# EAGLE design MySecondMicrocontroller (EAGLE 9.0.1)

## Sheet 1 of 3
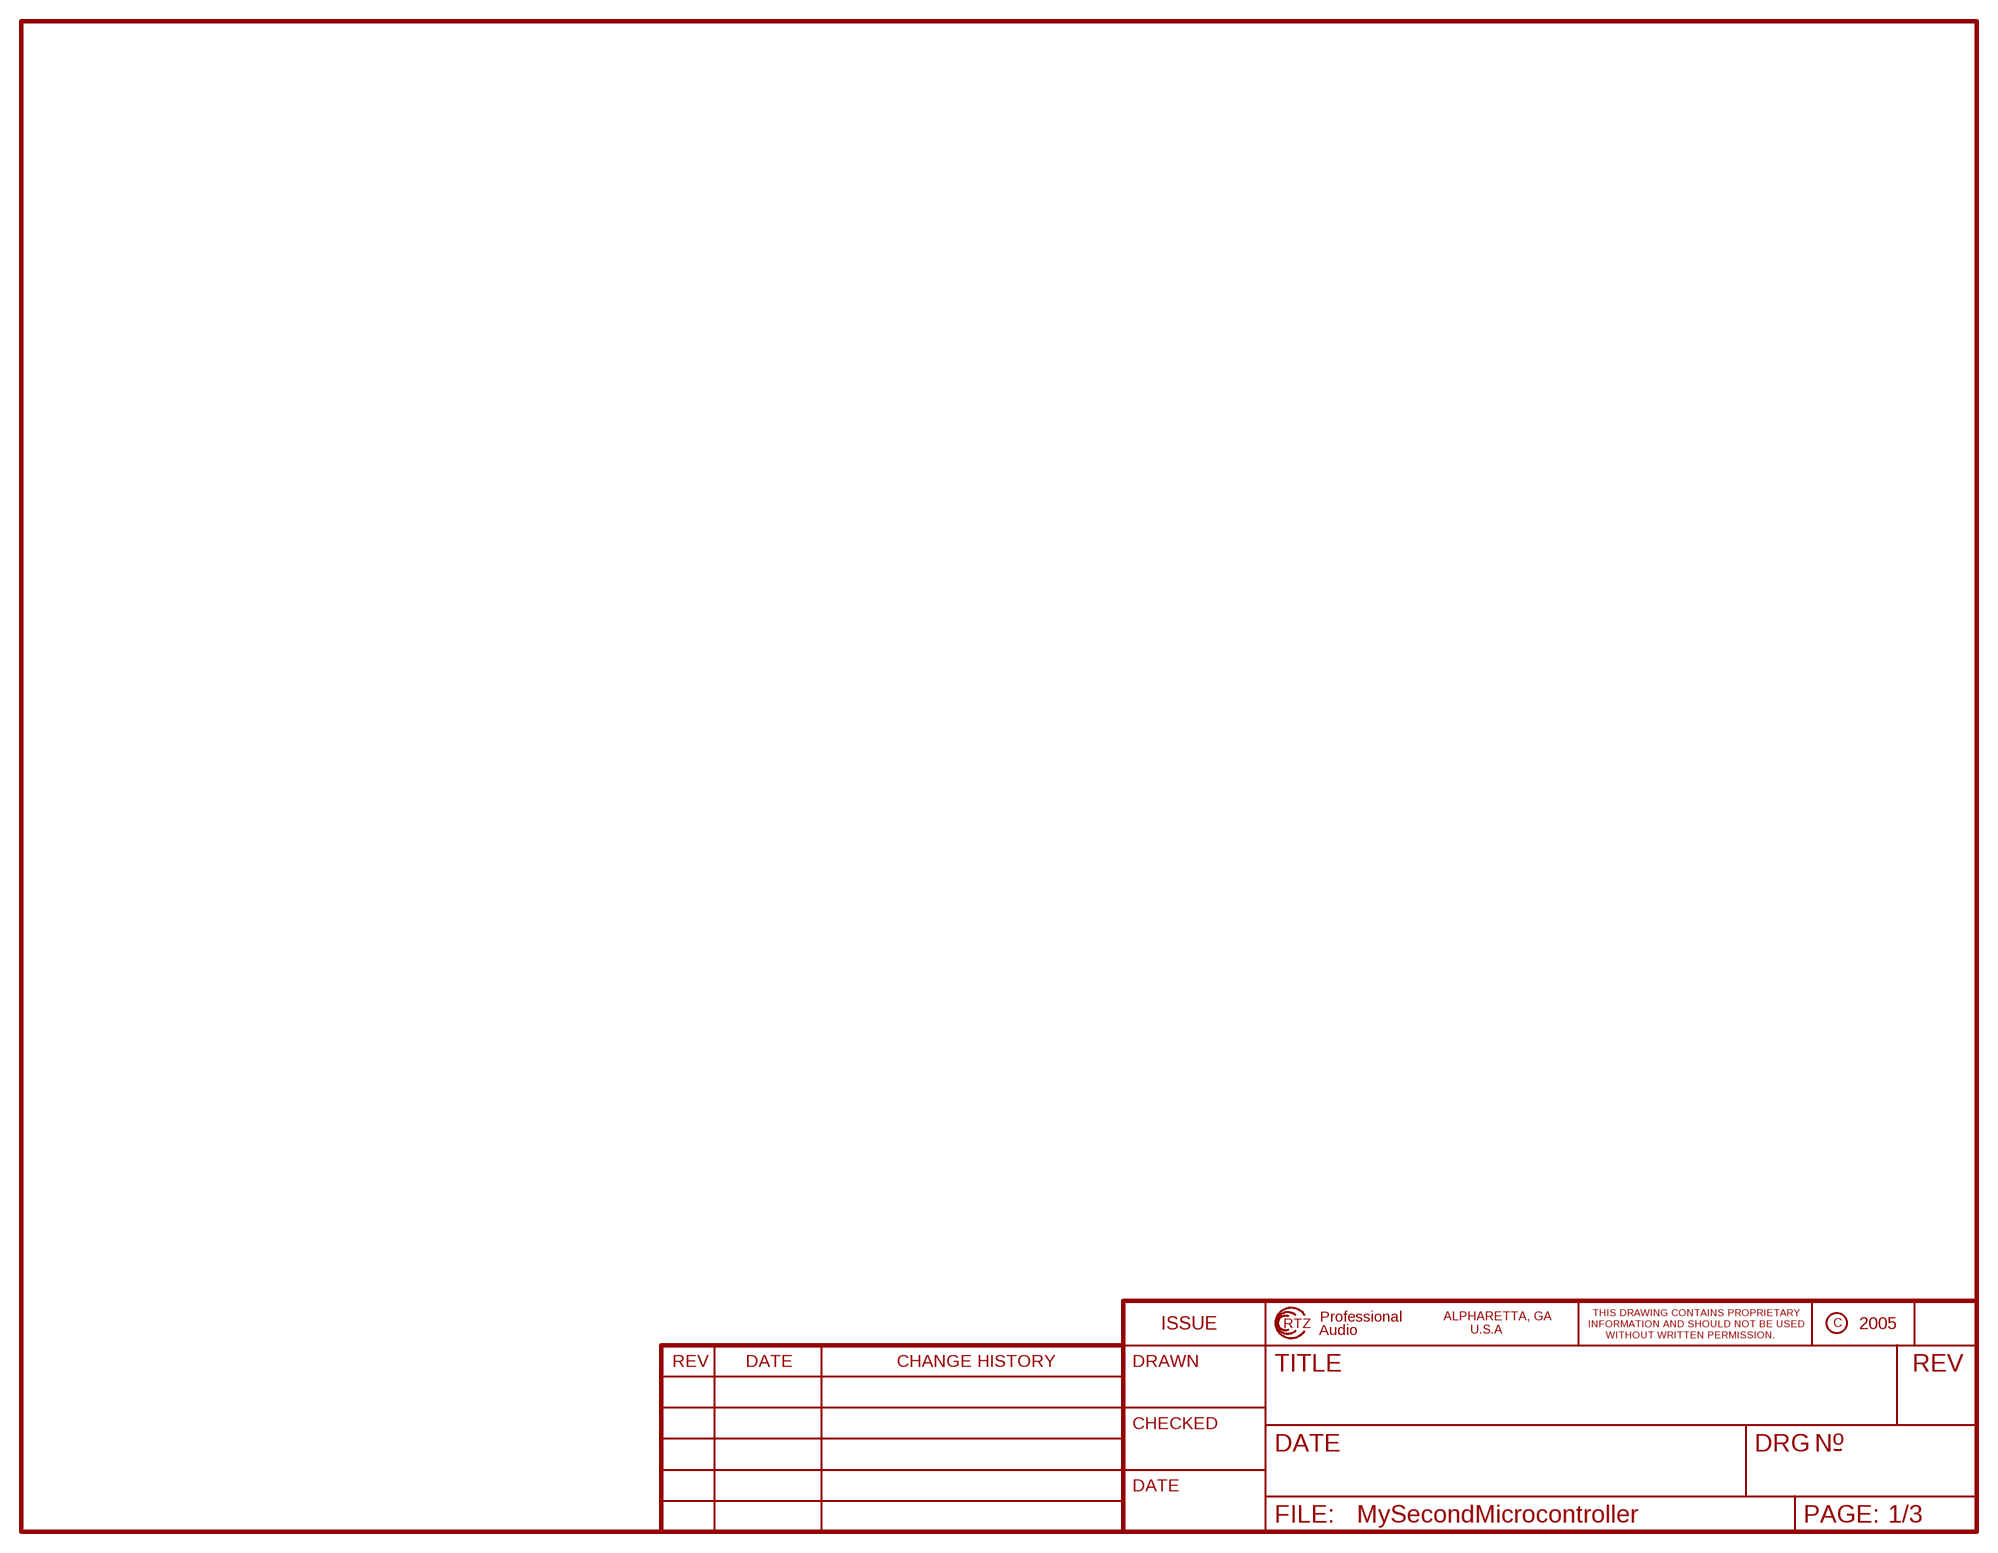
[diagram p0: schematic, sheet 1]

## Sheet 2 of 3
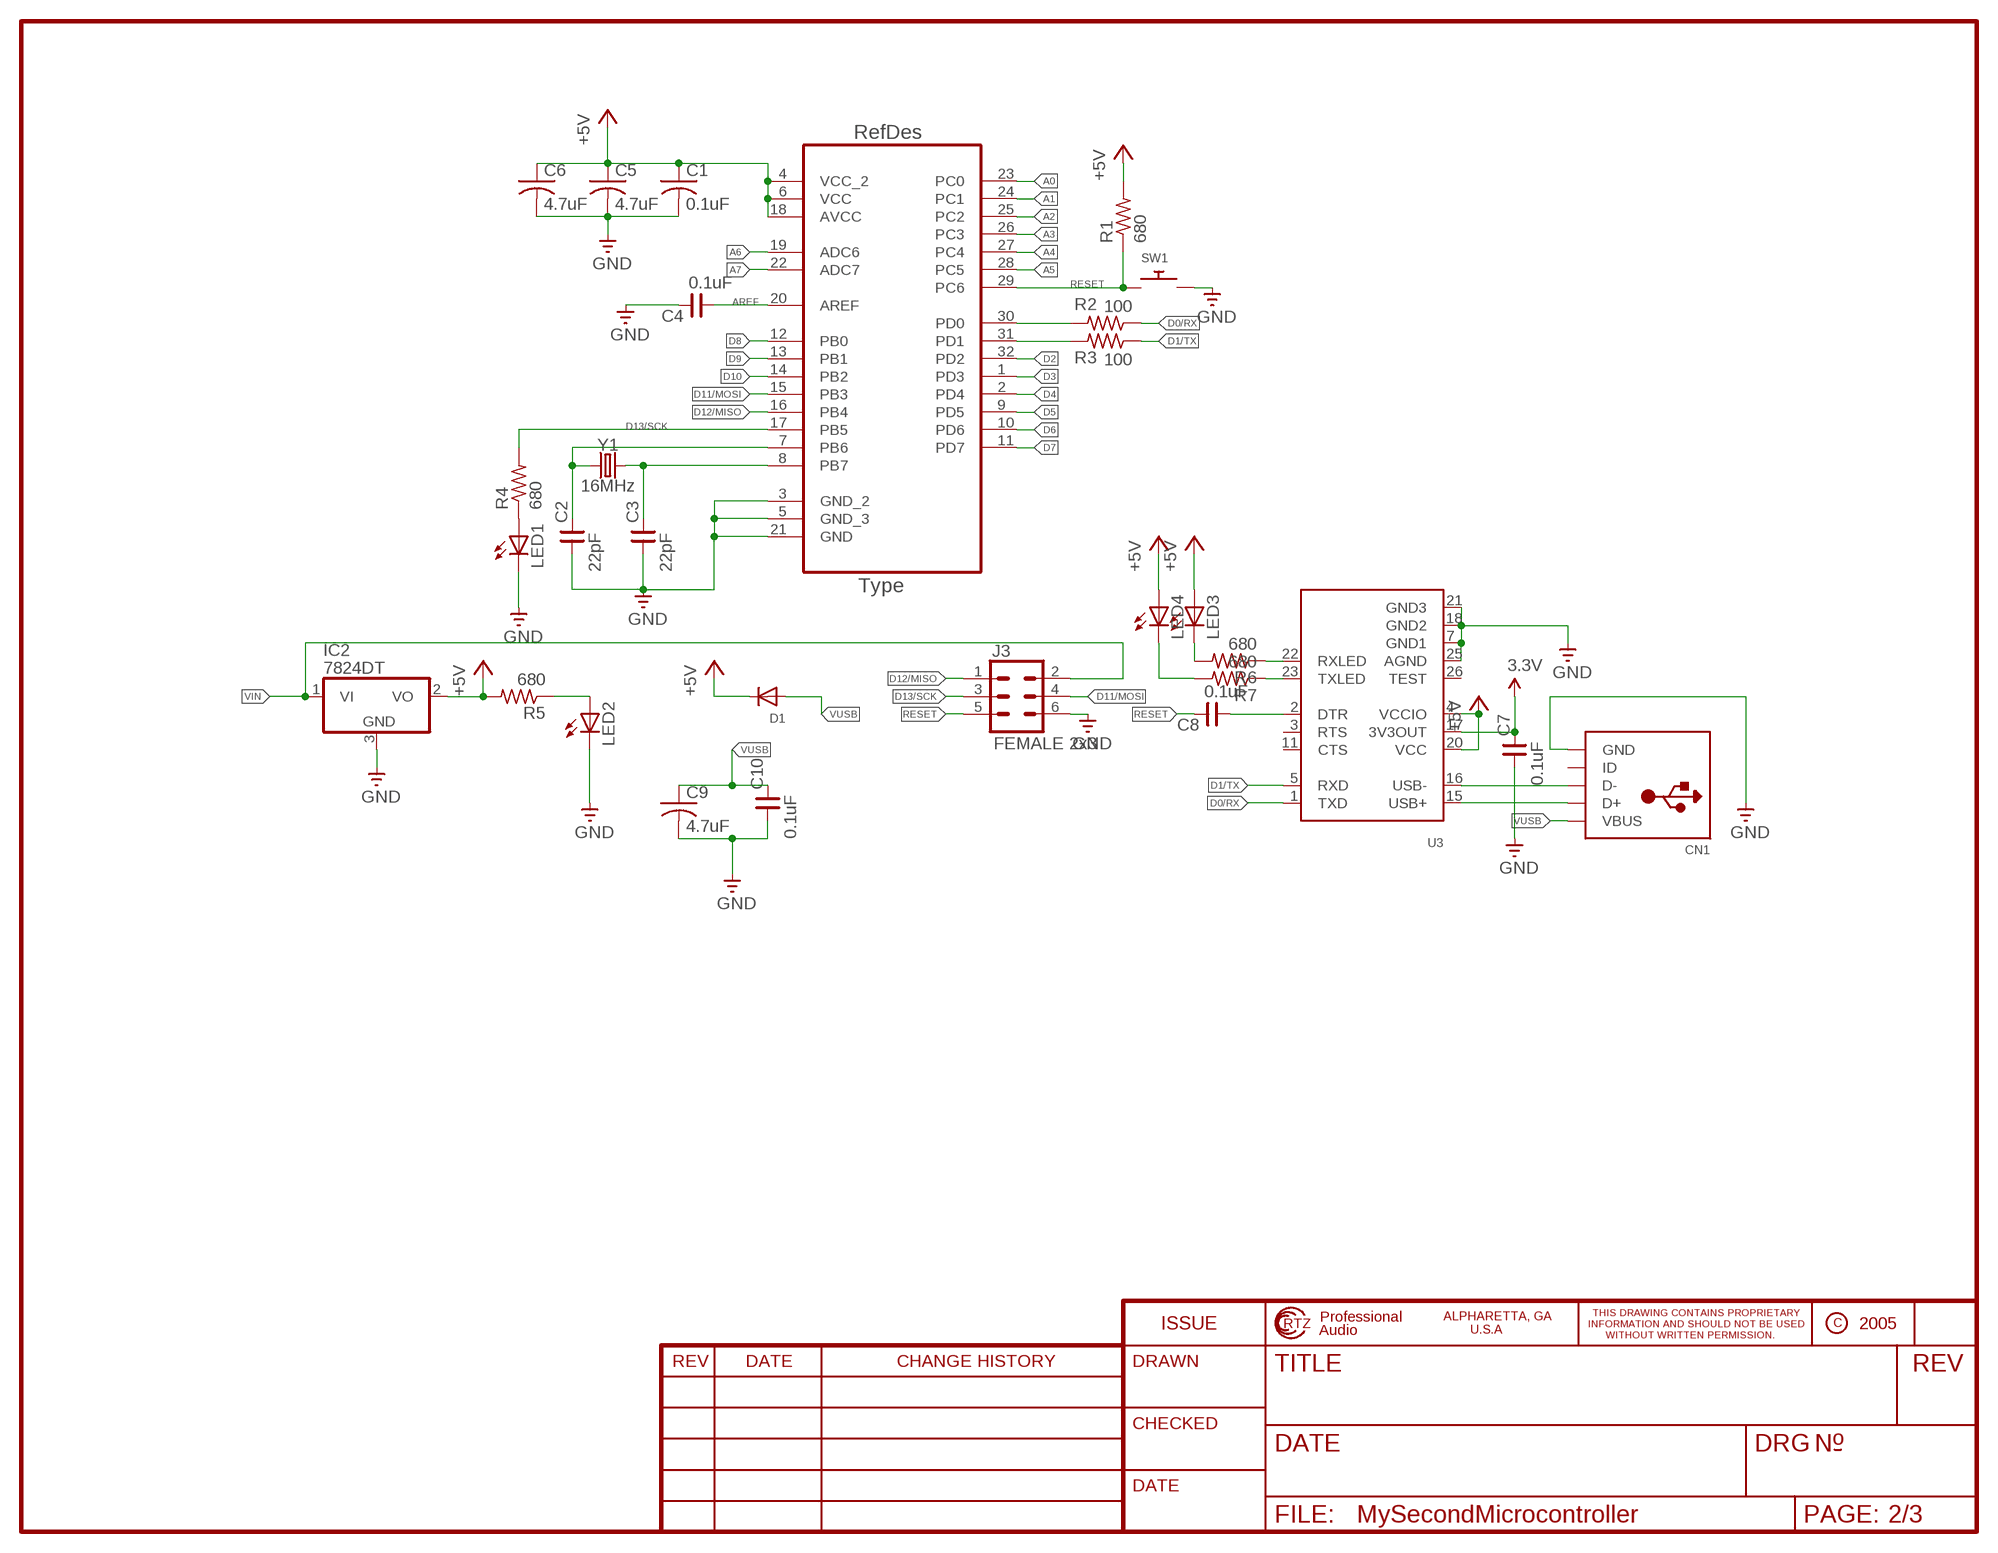
[diagram p1: schematic, sheet 2]

### Parts
C1  0.1uF  C-USC0805  [C0805]
C2  22pF  CNP-0805  [0805]
C3  22pF  CNP-0805  [0805]
C4  0.1uF  CNP-0805  [0805]
C5  4.7uF  C-USC0805  [C0805]
C6  4.7uF  C-USC0805  [C0805]
C7  0.1uF  CNP-0805  [0805]
C8  0.1uF  CNP-0805  [0805]
C9  4.7uF  C-USC0805  [C0805]
C10  0.1uF  CNP-0805  [0805]
CN1  USBMINIB  [USB-MINIB]
D1  DIODESOD-123  [SOD-123]
IC2  7824DT  [TO252]
J3  FEMALE 2x3  CONN_03X2FEMALE  [2X3]
LED1  LEDCHIPLED_0805  [CHIPLED_0805]
LED2  LEDCHIPLED_0805  [CHIPLED_0805]
LED3  LEDCHIPLED_0805  [CHIPLED_0805]
LED4  LEDCHIPLED_0805  [CHIPLED_0805]
R1  680  R-US_R0805  [R0805]
R2  100  R-US_R0805  [R0805]
R3  100  R-US_R0805  [R0805]
R4  680  R-US_R0805  [R0805]
R5  680  R-US_R0805  [R0805]
R6  680  R-US_R0805  [R0805]
R7  680  R-US_R0805  [R0805]
SW1  SWITCH_PUSHBUTTONEVQ-PE  [TACT_PANA-EVQ]
U2  ATMEGA328P-AU  [QFP80P900X900X120-32N]
U3  FT232RLSSOP28  [SSOP28DB]
Y1  16MHz  CRYSTAL-16MHZPTH-HC49US  [HC49US]

### Nets
3.3V: C7.2 U3.17(3V3OUT)
+5V [5V]: C1.1 C5.1 C6.1 D1.C IC2.2(VO) LED3.A LED4.A R1.2 R5.2 U2.4(VCC_2) U2.6(VCC) U2.18(AVCC) U3.4(VCCIO) U3.20(VCC)
A0: U2.23(PC0)
A1: U2.24(PC1)
A2: U2.25(PC2)
A3: U2.26(PC3)
A4: U2.27(PC4)
A5: U2.28(PC5)
A6: U2.19(ADC6)
A7: U2.22(ADC7)
AREF: C4.1 U2.20(AREF)
D0/RX: R2.1 U3.1(TXD)
D1/TX: R3.1 U3.5(RXD)
D2: U2.32(PD2)
D3: U2.1(PD3)
D4: U2.2(PD4)
D5: U2.9(PD5)
D6: U2.10(PD6)
D7: U2.11(PD7)
D8: U2.12(PB0)
D9: U2.13(PB1)
D10: U2.14(PB2)
D11/MOSI: J3.4 U2.15(PB3)
D12/MISO: J3.1 U2.16(PB4)
D13/SCK: J3.3 R4.2 U2.17(PB5)
GND: C1.2 C2.1 C3.1 C4.2 C5.2 C6.2 C7.1 C9.2 C10.1 CN1.GND IC2.3(GND) J3.6 LED1.C LED2.C SW1.P$2 U2.3(GND_2) U2.5(GND_3) U2.21(GND) U3.7(GND1) U3.18(GND2) U3.21(GND3) U3.25(AGND)
N$1: C3.2 U2.8(PB7) Y1.2
N$2: C2.2 U2.7(PB6) Y1.1
N$4: LED2.A R5.1
N$5: CN1.D+ U3.15(USB+)
N$6: CN1.D- U3.16(USB-)
N$7: R2.2 U2.30(PD0)
N$8: R3.2 U2.31(PD1)
N$9: LED3.C R6.2
N$12: R6.1 U3.22(RXLED)
N$13: R7.1 U3.23(TXLED)
N$14: C8.1 U3.2(DTR)
N$15: LED4.C R7.2
RESET: C8.2 J3.5 R1.1 SW1.P$1 U2.29(PC6)
VIN: IC2.1(VI) J3.2
VUSB: C9.1 C10.2 CN1.VBUS D1.A
Unconnected: CN1.ID LED1.A R4.1 U3.3(RTS) U3.11(CTS) U3.26(TEST)

## Sheet 3 of 3

## Library data of the parts
C1 C5 C6 C9 = adafruit:C-US: CAPACITOR, American symbol
C2-C4 C7 C8 C10 = cap-master:CNP-: NON-POLARIZED CAP
CN1 = adafruit:USB: USB Connectors USBMINIB - Surface Mount Female Mini-B USB Connector 4UConnector: 06564 By microbuilder.eu Thru-hole RA Female Mini-B USB Connector 4UConnector: 18732 By ladyada.net
D1 = adafruit:DIODE: Diode SMADIODE - SMA Surface Mount Package 20V 1A Schottky Diode Digikey: 641-1014-6-ND DO-1N4148 - Through Hole Small Current Diode SOD-123 20V 1 A (.5mV Vf) Schottky Diode - Digikey: MBRX120TPMSCT-ND SOD-323 10V 570mA (.38mV Vf, 3ns) Schottky Diode - Digikey: ZLLS410CT-ND SOD-523 30V 30mA Schottky Diode (RB751S-40TE61) - Digikey: RB751S-40TE61CT-ND SOT23-R/W - SOT23 Package (R = Solder Paste/Reflow Ovens, W = Hand-Soldering) BAT54Film 40V 300mA - Digikey: 497-7162-1-ND
IC2 = adafruit:78*: Positive VOLTAGE REGULATOR Added bigger pads to the TO-92 package
J3 = SparkFun-Connectors:CONN_03X2: Multi connection point. Often used as Generic Header-pin footprint for 0.1 inch spaced/style header connections You can populate with any combo of single row headers, but if you'd like an exact match, check these: Header - 2x3 (Male, 0.1") <https://www.sparkfun.com/products/12807> (PRT-12807) Header - 2x3 (Female, 0.1") <https://www.sparkfun.com/products/13010> (PRT-13010) 2x3 Pin Shrouded Header <https://www.sparkfun.com/products/10877> (PRT-10877) On any of the 0.1 inch spaced packages, you can populate with these: Break Away Headers - Straight <https://www.sparkfun.com/products/116> (PRT-00116) Break Away Male Headers - Right Angle <https://www.sparkfun.com/products/553> (PRT-00553) Female Headers <https://www.sparkfun.com/products/115> (PRT-00115) Break Away Headers - Machine Pin <https://www.sparkfun.com/products/117> (PRT-00117) Break Away Female Headers - Swiss Machine Pin <https://www.sparkfun.com/products/743> (PRT-00743) Special note: the shrouded connector mates well with our 3x2 ribbon cables: Ribbon Crimp Connector - 6-pin (2x3, Female) <https://www.sparkfun.com/products/10651> (PRT-10651) Ribbon Cable - 6 wire (15ft) <https://www.sparkfun.com/products/10646> (PRT-10646); PROD_ID: CONN-11566
LED1-LED4 = adafruit:LED: LED OSRAM: - CHIPLED LG R971, LG N971, LY N971, LG Q971, LY Q971, LO R971, LY R971 LH N974, LH R974 LS Q976, LO Q976, LY Q976 LO Q996 - Hyper CHIPLED LW Q18S LB Q993, LB Q99A, LB R99A - SideLED LS A670, LO A670, LY A670, LG A670, LP A670 LB A673, LV A673, LT A673, LW A673 LH A674 LY A675 LS A676, LA A676, LO A676, LY A676, LW A676 LS A679, LY A679, LG A679 - Hyper Micro SIDELED® LS Y876, LA Y876, LO Y876, LY Y876 LT Y87S - SmartLED LW L88C, LW L88S LB L89C, LB L89S, LG L890 LS L89K, LO L89K, LY L89K LS L896, LA L896, LO L896, LY L896 - TOPLED LS T670, LO T670, LY T670, LG T670, LP T670 LSG T670, LSP T670, LSY T670, LOP T670, LYG T670 LG T671, LOG T671, LSG T671 LB T673, LV T673, LT T673, LW T673 LH T674 LS T676, LA T676, LO T676, LY T676, LB T676, LH T676, LSB T676, LW T676 LB T67C, LV T67C, LT T67C, LS T67K, LO T67K, LY T67K, LW E67C LS E67B, LA E67B, LO E67B, LY E67B, LB E67C, LV E67C, LT E67C LW T67C LS T679, LY T679, LG T679 LS T770, LO T770, LY T770, LG T770, LP T770 LB T773, LV T773, LT T773, LW T773 LH T774 LS E675, LA E675, LY E675, LS T675 LS T776, LA T776, LO T776, LY T776, LB T776 LHGB T686 LT T68C, LB T68C - Hyper Mini TOPLED® LB M676 - Mini TOPLED Santana® LG M470 LS M47K, LO M47K, LY M47K Source: http://www.osram.convergy.de/
R1-R7 = adafruit:R-US_: RESISTOR, American symbol
SW1 = adafruit:SWITCH_PUSHBUTTON: Buttons SOFTTOUCHSMD_SJ - Soft touch temporary push button (Super Junk Akihabara) Compatible with SKPMANE010 [Mouser: 688-SKPMAN] C&K_KSS = Digikey: KSS221GLFS
U2 = Atmel-ATMEGA328P-AU:ATMEGA328P-AU; DESCRIPTION: 8-bit Microcontroller with In-System Programmable Flash; MPN: ATMEGA328P-AU; OC_FARNELL: 1715486; OC_NEWARK: 14R4631; PACKAGE: TQFP-32; SUPPLIER: Atmel
U3 = microbuilder:FT232RL: FTDI FT232RL USB TO RS232 Converter Digikey: 768-1007-1-ND
Y1 = SparkFun-Clocks:CRYSTAL-16MHZ: 16MHz Crystal Digikey Example <http://www.digikey.com/product-search/en?keywords=535-9122-1-ND> Frequency: 16MHz Frequency Stability: ±50ppm Frequency Tolerance: ±20ppm Load Capacitance: 18pF SparkFun Products: Pro Micro -5V/16MHz <https://www.sparkfun.com/products/12640> SparkFun Serial Enabled LCD Kit <https://www.sparkfun.com/products/10097>; PROD_ID: XTAL-08181; SF_ID: COM-00536

## Net classes
0 default: width 0.152 mm
1 5V: width 0.508 mm

## Board
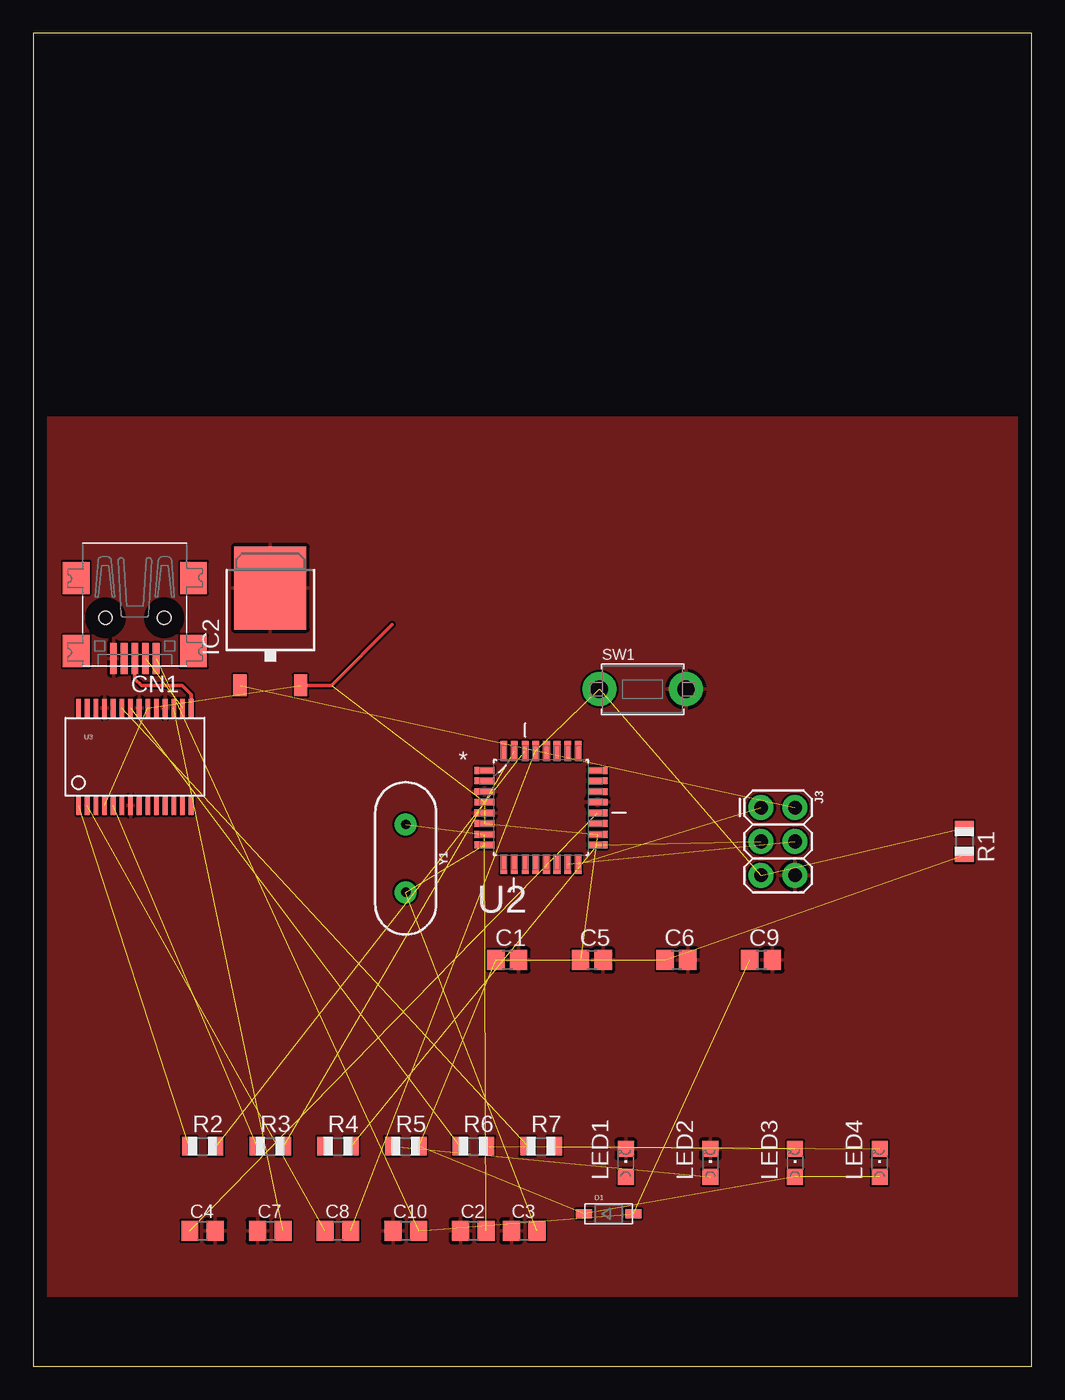
[diagram p2: board, top side]
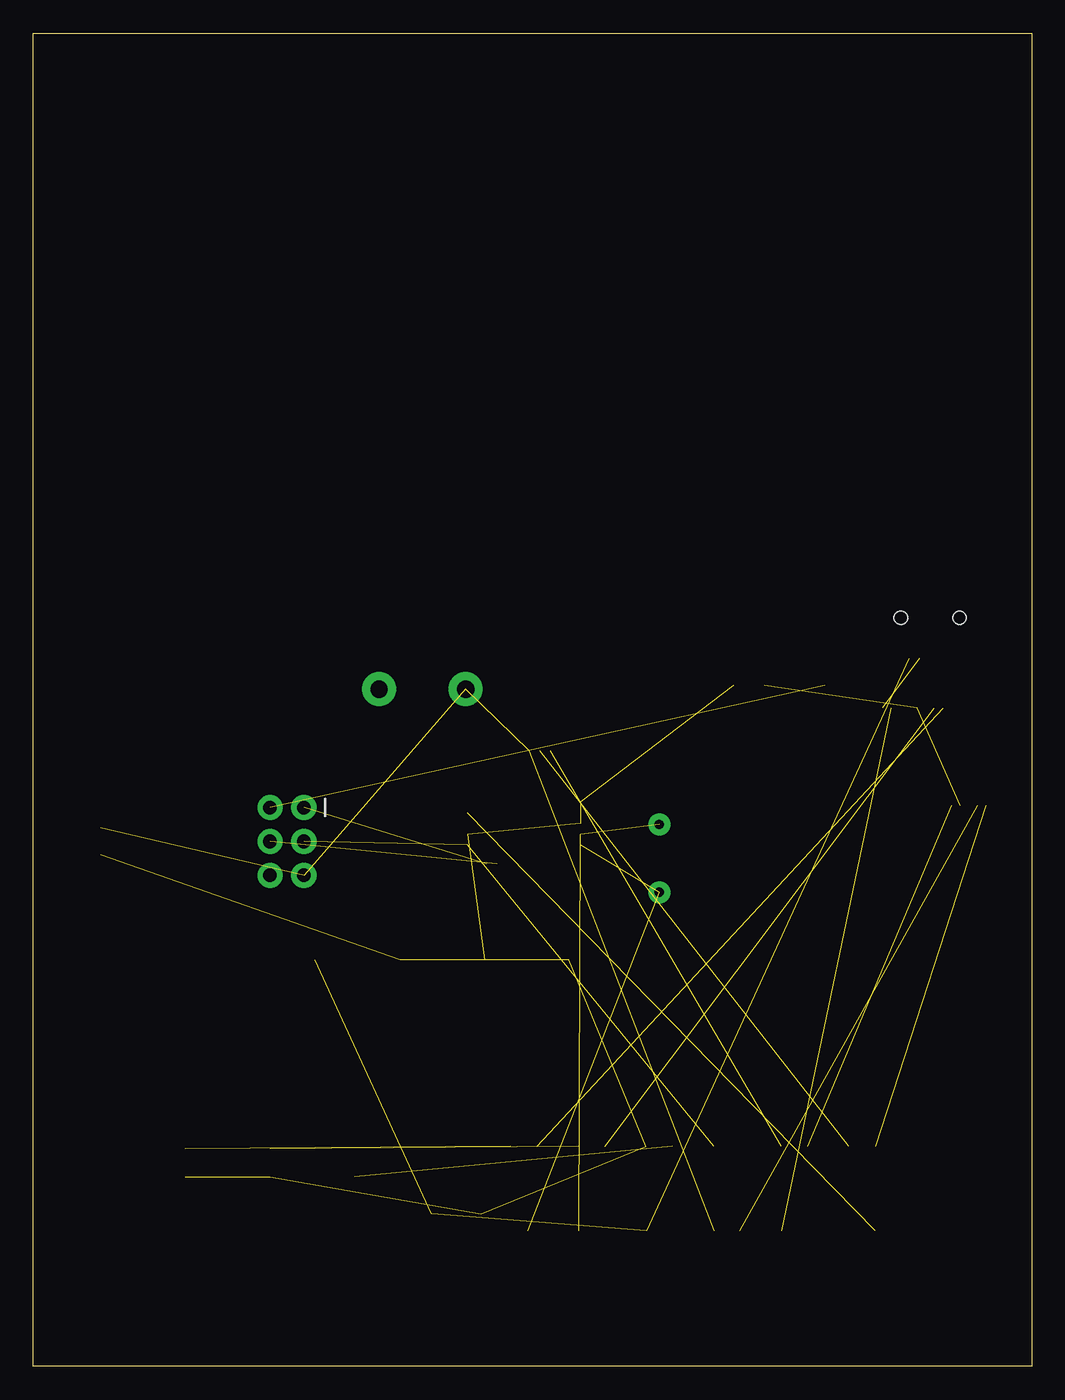
[diagram p3: board, bottom side, seen from below]

Size 74.91 x 100 mm. Coordinates in mm from the lower left corner, seen from the top.
Outline: 0,0 74.91,0 74.91,100 0,100 0,0
Copper layers (1*16): Top 0.035mm / dielectric 1.5mm / Bottom 0.035mm
Design rules "default": minimum track width 6mil, minimum drill 0.35mm, track to track 6mil, track to pad 6mil, pad to pad 6mil, via to via 6mil, smd to smd 6mil, copper to edge 40mil, drill to drill 6mil, minimum pad ring 10mil, minimum via ring 8mil, stop-mask expansion 4mil, vias tented up to drill 0mil, thermal gap 10mil

### Footprints (pad centres in the part's own frame; a part is rotated, then mirrored left to right if it is on the bottom)
C0805 = smd 1.3 x 1.5: 1 -0.85,0; 2 0.85,0
0805 = smd 1.27 x 1.524: 1 -0.953,0; 2 0.953,0
USB-MINIB = smd 0.5 x 2.308: D+ 0,4.064; D- -0.8,4.064; GND 1.6,4.064; ID 0.8,4.064; VBUS -1.6,4.064 | smd 2 x 2.4: GND1 -4.4,-2; GND2 -4.4,3.5; GND3 4.4,3.5; GND4 4.4,-2 | hole 1: -2.2,1; 2.2,1
SOD-123 = smd 1.2 x 0.7: A 1.85,0; C -1.85,0
TO252 = smd 1 x 1.6: 1 -2.28,-4.8; 2 2.28,-4.8 | smd 5.4 x 6.2: 3 0,2.5
2X3 = drill 1.016 pad 1.88: 1 0,0; 2 0,2.54; 3 2.54,0; 4 2.54,2.54; 5 5.08,0; 6 5.08,2.54
CHIPLED_0805 = smd 1.2 x 1.2: A 0,-1.05; C 0,1.05
R0805 = smd 1.1 x 1.4: 1 -1,0; 2 1,0
TACT_PANA-EVQ = drill 1.3 pad 2.54: P$1 -3.25,0; P$2 3.25,0
QFP80P900X900X120-32N = smd 1.473 x 0.508: 1 -4.242,2.794; 2 -4.242,2.007; 3 -4.242,1.194; 4 -4.242,0.406; 5 -4.242,-0.406; 6 -4.242,-1.194; 7 -4.242,-2.007; 8 -4.242,-2.794; 17 4.242,-2.794; 18 4.242,-2.007; 19 4.242,-1.194; 20 4.242,-0.406; 21 4.242,0.406; 22 4.242,1.194; 23 4.242,2.007; 24 4.242,2.794 | smd 0.508 x 1.473: 9 -2.794,-4.242; 10 -2.007,-4.242; 11 -1.194,-4.242; 12 -0.406,-4.242; 13 0.406,-4.242; 14 1.194,-4.242; 15 2.007,-4.242; 16 2.794,-4.242; 25 2.794,4.242; 26 2.007,4.242; 27 1.194,4.242; 28 0.406,4.242; 29 -0.406,4.242; 30 -1.194,4.242; 31 -2.007,4.242; 32 -2.794,4.242
SSOP28DB = smd 0.348 x 1.397: 1 -4.225,-3.656; 2 -3.575,-3.656; 3 -2.925,-3.656; 4 -2.275,-3.656; 5 -1.625,-3.656; 6 -0.975,-3.656; 7 -0.325,-3.656; 8 0.325,-3.656; 9 0.975,-3.656; 10 1.625,-3.656; 11 2.275,-3.656; 12 2.925,-3.656; 13 3.575,-3.656; 14 4.225,-3.656; 15 4.225,3.656; 16 3.575,3.656; 17 2.925,3.656; 18 2.275,3.656; 19 1.625,3.656; 20 0.975,3.656; 21 0.325,3.656; 22 -0.325,3.656; 23 -0.975,3.656; 24 -1.625,3.656; 25 -2.275,3.656; 26 -2.925,3.656; 27 -3.575,3.656; 28 -4.225,3.656
HC49US = drill 0.7 pad 1.651: 1 -2.54,0; 2 2.54,0

### Placement (x,y rotation side)
C1  35.56,30.48 0 top
C2  33.02,10.16 0 top
C3  36.83,10.16 0 top
C4  12.7,10.16 0 top
C5  41.91,30.48 0 top
C6  48.26,30.48 0 top
C7  17.78,10.16 0 top
C8  22.86,10.16 0 top
C9  54.61,30.48 0 top
C10  27.94,10.16 0 top
CN1  7.62,57.15 180 top
D1  43.18,11.43 0 top
IC2  17.78,55.88 0 top
J3  54.61,41.91 270 top
LED1  44.45,15.24 0 top
LED2  50.8,15.24 0 top
LED3  57.15,15.24 0 top
LED4  63.5,15.24 0 top
R1  69.85,39.37 270 top
R2  12.7,16.51 0 top
R3  17.78,16.51 0 top
R4  22.86,16.51 0 top
R5  27.94,16.51 0 top
R6  33.02,16.51 0 top
R7  38.1,16.51 0 top
SW1  45.72,50.8 0 top
U2  38.1,41.91 0 top
U3  7.62,45.72 0 top
Y1  27.94,38.1 270 top

### Tracks (layer width: path | path; a pad name or v marks a point on that pad's centre or on a via)
3.3V  (1 unrouted)
+5V  (13 unrouted)
  Top 0.254: IC2.2 22.38,51.08 26.92,55.63
AREF  (1 unrouted)
D0/RX  (1 unrouted)
D1/TX  (1 unrouted)
D11/MOSI  (1 unrouted)
D12/MISO  (1 unrouted)
D13/SCK  (2 unrouted)
GND
  pour Top: -0.25,70.87 -0.25,5.33 74.68,5.33 74.68,71.12 -0.25,71.12
N$1  (2 unrouted)
N$2  (2 unrouted)
N$4  (1 unrouted)
N$5
  Top 0.254: CN1.D+ 7.62,51.56 8.13,51.05 11.18,51.05 11.85,50.38 U3.15
N$6  (1 unrouted)
N$7  (1 unrouted)
N$8  (1 unrouted)
N$9  (1 unrouted)
N$12  (1 unrouted)
N$13  (1 unrouted)
N$14  (1 unrouted)
N$15  (1 unrouted)
RESET  (4 unrouted)
VIN  (1 unrouted)
VUSB  (3 unrouted)